# Altium schematic sheet Power.SchDoc
size A
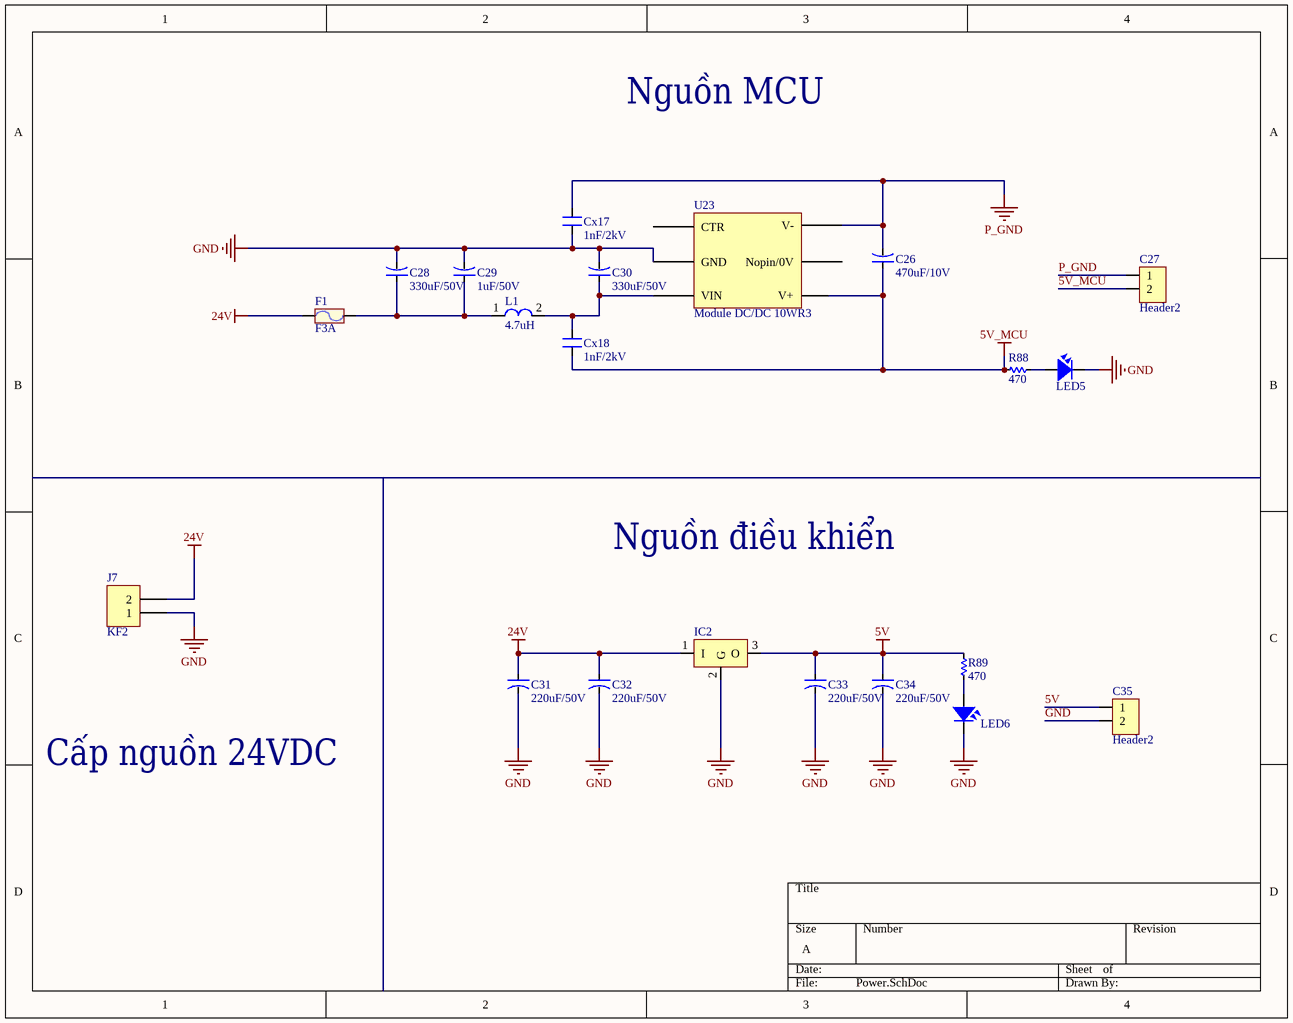
[diagram p0: Power.SchDoc]

## Parts
C26  470uF/10V  [TANTALUM-7343]
C27  Header2  [Header2]
C28  330uF/50V  [CAP-ALU-SMD-G]
C29  1uF/50V  [CAP-ALU-SMD-4.5x5x1.4]
C30  330uF/50V  [CAP-ALU-SMD-G]
C31  220uF/50V  [CAP-ALU-SMD-6.3x7.7x2.2]
C32  220uF/50V  [CAP-ALU-SMD-6.3x7.7x2.2]
C33  220uF/50V  [CAP-ALU-SMD-6.3x7.7x2.2]
C34  220uF/50V  [CAP-ALU-SMD-6.3x7.7x2.2]
C35  Header2  [Header2]
Cx17  1nF/2kV  [CN2-B]
Cx18  1nF/2kV  [CN2-B]
F1  F3A  [FUSE_SMD 1812]
IC2  LM78xx  [TO252-123]  (value not drawn)
J7  KF2  [KF2-7.62]
L1  4.7uH  [L-SMD-M-12x10]
LED5  LED  [LED-1206-Red]  (value not drawn)
LED6  LED  [LED-1206-Red]  (value not drawn)
R88  470  [RES-SMD-0805]
R89  470  [RES-SMD-0805]
U23  Module DC/DC 10WR3  [Module DC DC 10W/R3]

## Nets
5V: C33.1 C34.1 C35.1 IC2.3(O) R89.1
5V_MCU: C26.1 C27.2 Cx18.1 R88.1 U23.V+
24V: C31.1 C32.1 F1.1 IC2.1(I) J7.2
GND: C28.2 C29.2 C30.2 C31.2 C32.2 C33.2 C34.2 C35.2 Cx17.1 IC2.2(G) J7.1 LED5.2 LED6.2 U23.GND
P_GND: C26.2 C27.1 Cx17.2 U23.V-
NetC28_1: C28.1 C29.1 F1.2 L1.1
NetC30_1: C30.1 Cx18.2 L1.2 U23.VIN
NetLED5_1: LED5.1 R88.2
NetLED6_1: LED6.1 R89.2

Not connected (* = marked no-connect by the designer): U23 CTR Nopin/0V

## Notes on the sheet
- Nguồn MCU
- Nguồn điều khiển
- Cấp nguồn 24VDC

## Library data of the parts
C26 = CN-TANTALUM-SMD
C27 C35 = Header2: Header IDC, 2 x 1 Pin Vertical 2.54mm Pitch (Non-Boxed, Male); Manufacturer: W¨¹rth Elektronik eiSos GmbH; partNo: 613002143121; ComponentLink1 Description: Manufacturer; ComponentLink2 Description: Datasheet; NoPins: 02; Created Date: 29 March 2013; ComponentLink1URL: http://www.we-online.com; ComponentLink2URL: http://katalog.we-online.de/em/datasheet/6130xx143121.pdf; Created by: Karrer Zheng
C28-C34 = CN-ALU-SMD: Polarized Capacitor (Axial); Published: 8-Jun-2000; LatestRevisionDate: 17-Jul-2002; LatestRevisionNote: Re-released for DXP Platform.; PackageReference: POLAR0.8; Publisher: Altium Limited
Cx17 Cx18 = CN: Value: 33pF
F1 = Fuse: Designed by: VanDungEvn; Value: Fuse
IC2 = LM78xx: Positive Voltage Regulator; Note: Tab is connected to pin 3 (GND).; Published: 24-Aug-2001; LatestRevisionDate: 17-Jul-2002; LatestRevisionNote: Re-released for DXP Platform.; DatasheetVersion: Apr-1994; PackageVersion: Jul-1998; PackageReference: ISOWATT220AB; Publisher: Altium Limited; PackageDescription: TO, Thru-Hole, Vertical, Heatsink Mounted; 3 In-Line Leads; Pitch 2.54 mm; Pin sequence 1, 3, 2; ComponentLink1Description: Manufacturer Link; ComponentLink1URL: http://www.st.com/; ComponentLink2Description: Datasheet; ComponentLink2URL: http://www.st.com/stonline/products/literature/ds/2146/l78m05c.pdf
J7 = KF2: Manufacturer: Würth Elektronik eiSos GmbH; partNo: 691103110002; ComponentLink1 Description: Manufacturer; ComponentLink2 Description: Datasheet; NoPins: 2; Created Date: 29 October 2013; ComponentLink1URL: http://www.we-online.com; ComponentLink2URL: http://katalog.we-online.de/em/datasheet/6911031100xx.pdf; Created by: Karrer Zheng
L1 = L-SMD-1: partNo: 78477010; Manufacturer: Wurth Elektronik; Inductance: 1.0 μH; ComponentLink1Description: Manufacturer; ComponentLink1URL: http://www.we-online.de; Created by: Baojun Chen; Created Date: Nov.2015; ComponentLink2Description: Datasheet; ComponentLink2URL: http://katalog.we-online.de/pbs/datasheet/78477010.pdf
LED5 LED6 = LED SMD: Value: LED 3 - 5 ly 2 Colour
R88 R89 = Res-SMD: Resistor; Manufacturer: Generic Components; Class: Passive; Published: 08/06/2000; Publisher: Altium Hobart Technology Centre